# Altium schematic sheet Other.SchDoc
size A4
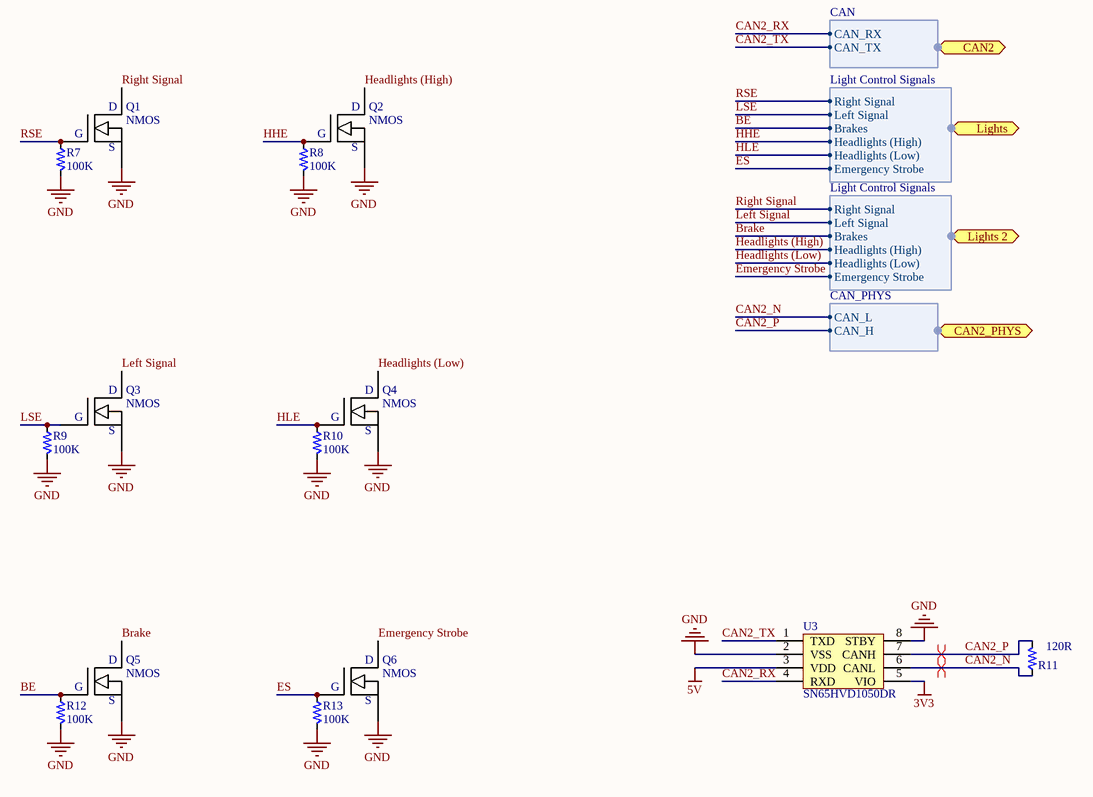
[diagram p0: Other.SchDoc]

## Parts
Q1  NMOS  [NMOS - SSM3K333R - SOTFL95P180X88-3M]
Q2  NMOS  [NMOS - SSM3K333R - SOTFL95P180X88-3M]
Q3  NMOS  [NMOS - SSM3K333R - SOTFL95P180X88-3M]
Q4  NMOS  [NMOS - SSM3K333R - SOTFL95P180X88-3M]
Q5  NMOS  [NMOS - SSM3K333R - SOTFL95P180X88-3M]
Q6  NMOS  [NMOS - SSM3K333R - SOTFL95P180X88-3M]
R7  Resistance: 100K  [PCB_GENERIC_SMD_0603]  (hidden comment: SCH_GENERIC_RESISTOR_0603)
R8  Resistance: 100K  [PCB_GENERIC_SMD_0603]  (hidden comment: SCH_GENERIC_RESISTOR_0603)
R9  Resistance: 100K  [PCB_GENERIC_SMD_0603]  (hidden comment: SCH_GENERIC_RESISTOR_0603)
R10  Resistance: 100K  [PCB_GENERIC_SMD_0603]  (hidden comment: SCH_GENERIC_RESISTOR_0603)
R11  Resistance: 120R  [PCB_GENERIC_SMD_0603]  (hidden comment: SCH_GENERIC_RESISTOR_0603)
R12  Resistance: 100K  [PCB_GENERIC_SMD_0603]  (hidden comment: SCH_GENERIC_RESISTOR_0603)
R13  Resistance: 100K  [PCB_GENERIC_SMD_0603]  (hidden comment: SCH_GENERIC_RESISTOR_0603)
U3  SN65HVD1050DR  [SOIC127P600X175-8N]

## Ports
CAN2 (harness CAN), CAN2_PHYS (harness CAN_PHYS), Lights 2 (harness Light Control Signals), Lights (harness Light Control Signals)

## Harnesses
CAN_PHYS: CAN_L, CAN_H
CAN: CAN_RX, CAN_TX
Light Control Signals: Right Signal, Left Signal, Brakes, Headlights (Low), Headlights (High), Emergency Strobe

## Nets
3V3: U3.5(VIO)
5V: U3.3(VDD)
GND: Q1.2(S) Q2.2(S) Q3.2(S) Q4.2(S) Q5.2(S) Q6.2(S) R7.2 R8.2 R9.2 R10.2 R12.2 R13.2 U3.2(VSS) U3.8(STBY)
BE: Q5.1(G) R12.1 ; port Lights.Brakes
Brake: Q5.3(D) ; port Lights 2.Brakes
CAN2_N: R11.1 U3.6(CANL) ; port CAN2_PHYS.CAN_L
CAN2_P: R11.2 U3.7(CANH) ; port CAN2_PHYS.CAN_H
CAN2_RX: U3.4(RXD) ; port CAN2.CAN_RX
CAN2_TX: U3.1(TXD) ; port CAN2.CAN_TX
Emergency Strobe: Q6.3(D) ; port Lights 2.Emergency Strobe
ES: Q6.1(G) R13.1 ; port Lights.Emergency Strobe
Headlights (High): Q2.3(D) ; port Lights 2.Headlights (High)
Headlights (Low): Q4.3(D) ; port Lights 2.Headlights (Low)
HHE: Q2.1(G) R8.1 ; port Lights.Headlights (High)
HLE: Q4.1(G) R10.1 ; port Lights.Headlights (Low)
Left Signal: Q3.3(D) ; port Lights 2.Left Signal
LSE: Q3.1(G) R9.1 ; port Lights.Left Signal
Right Signal: Q1.3(D) ; port Lights 2.Right Signal
RSE: Q1.1(G) R7.1 ; port Lights.Right Signal

## Layout directives
differential pair: CAN2_N, CAN2_P

## Library data of the parts
Q1-Q6 = NMOS - SSM3K333R
R7-R13 = SCH_GENERIC_RESISTOR_0603: Generic SMD resistor 0603
U3 = SN65HVD1050DR: IC EMC CAN TRANSCEIVER 8-SOIC; Supplier 1: Digi-Key; Supplier Part Number 1: 296-26335-1-ND